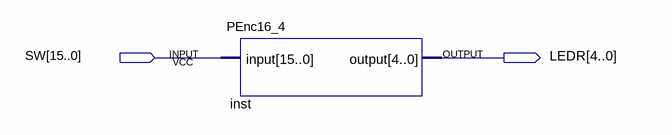
[diagram p0: schematic sheet]
// Quartus schematic PEnc16_4Demo.bdf as structural Verilog: 1 symbols, 2 pins
module PEnc16_4Demo (
  input  [15:0] SW,
  output [4:0] LEDR
);

  PEnc16_4 inst (.\input (SW), .\output (LEDR));
endmodule
